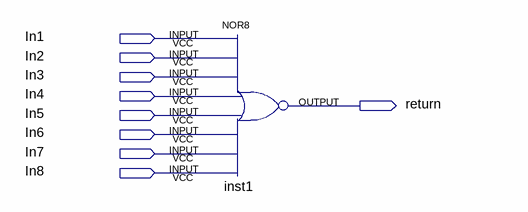
[diagram p0: schematic sheet]
// Quartus schematic Zero_scan.bdf as structural Verilog: 1 symbols, 9 pins
module Zero_scan (
  input  In1,
  input  In2,
  input  In3,
  input  In4,
  input  In5,
  input  In6,
  input  In7,
  input  In8,
  output \return 
);

  nor inst1 (\return , In1, In2, In3, In4, In5, In6, In7, In8);
endmodule
